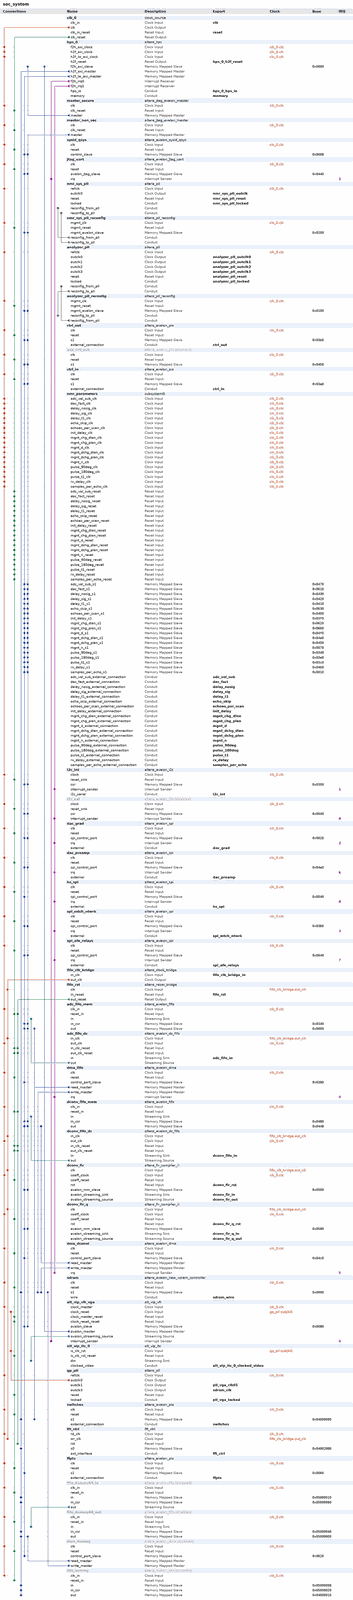
[diagram p0: system contents, whole]
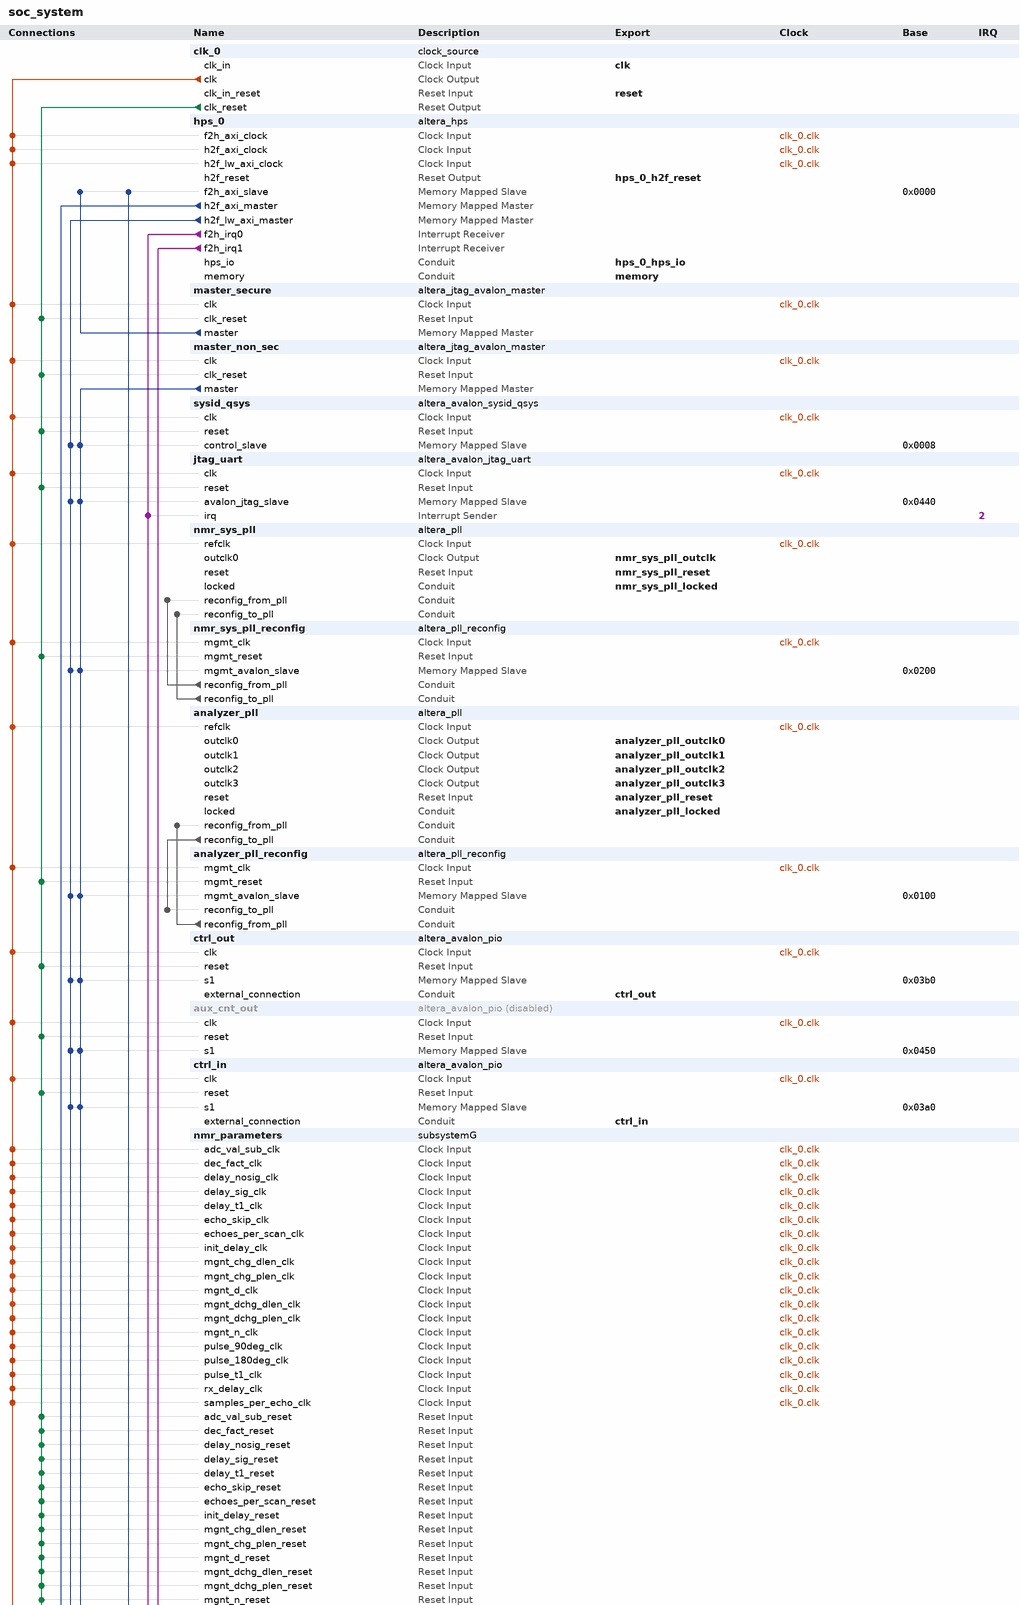
[diagram p1: system contents, upper part]
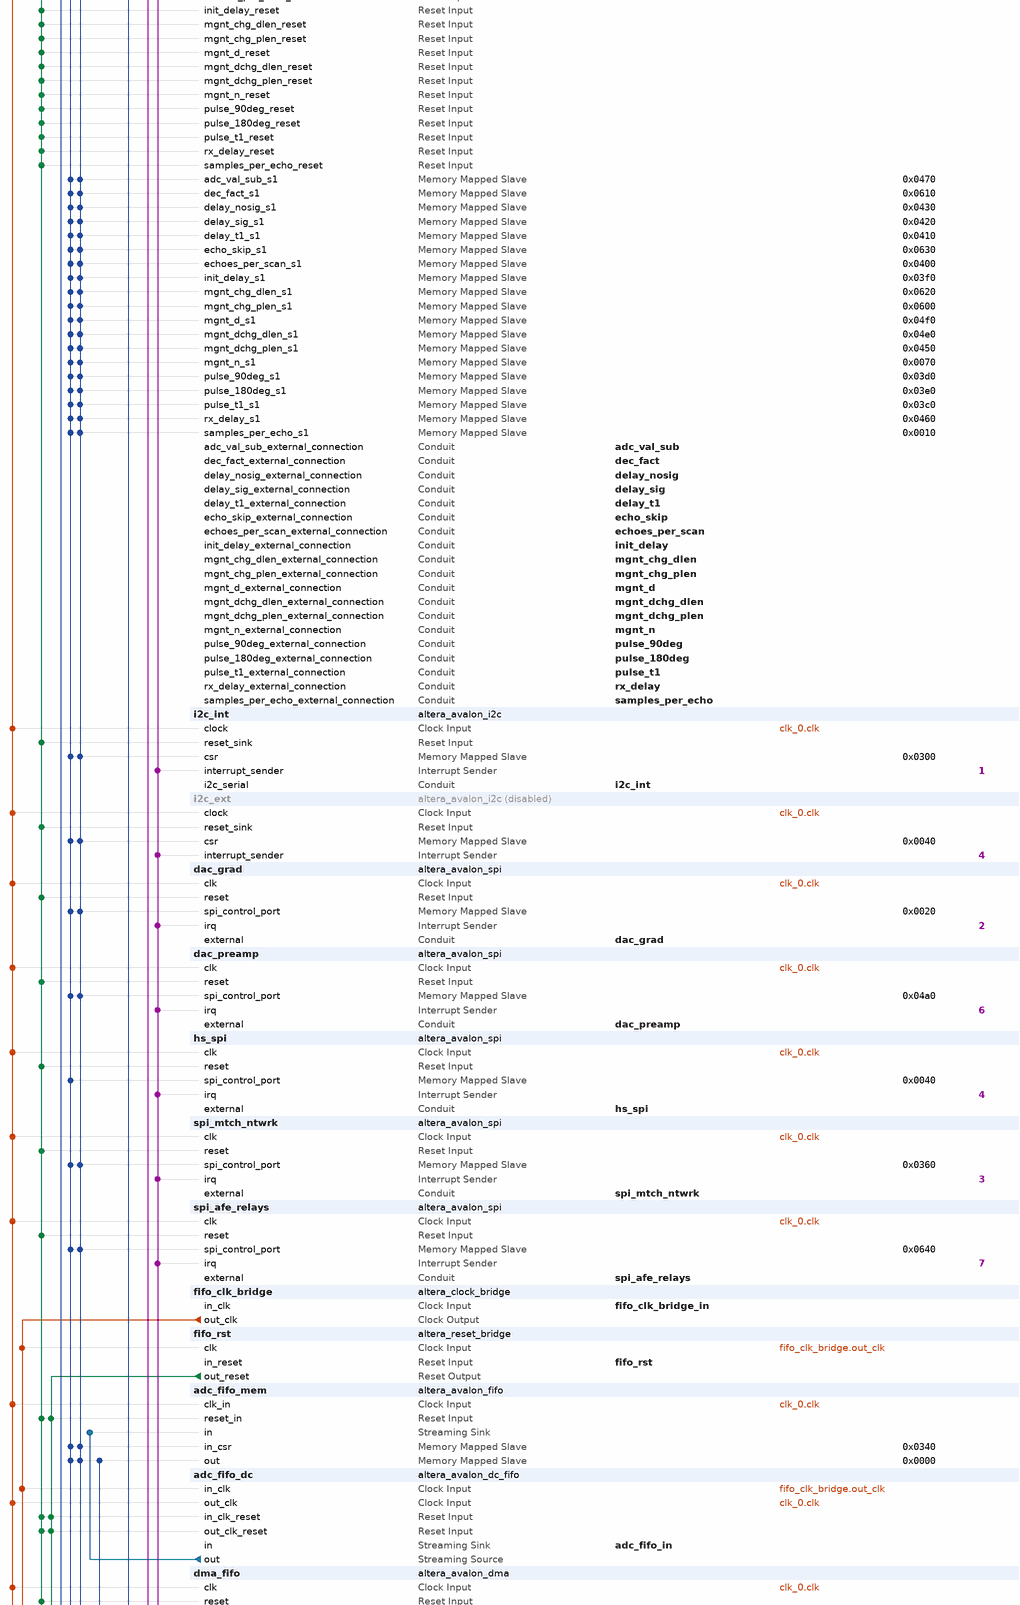
[diagram p2: system contents, middle part]
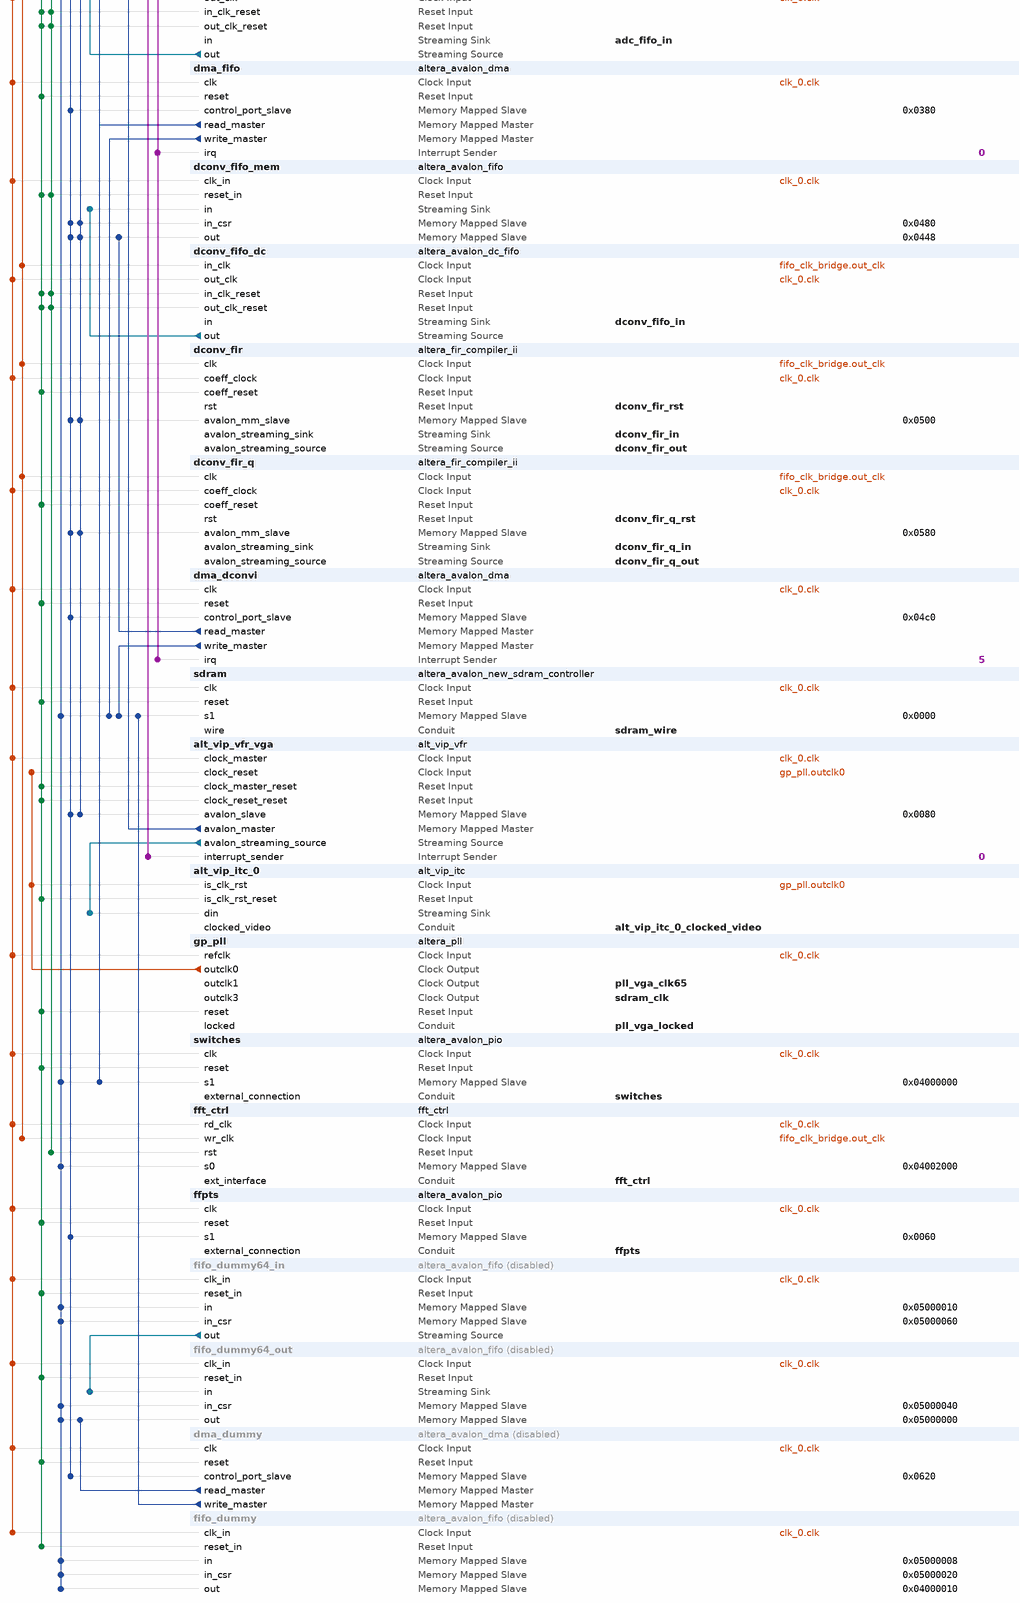
[diagram p3: system contents, lower part]
# Platform Designer (Qsys) system soc_system, Cyclone V 5CSEMA5F31C6
# Parameters at their usual value, and those the tool derives, are not listed.
package require -exact qsys 17.1
create_system soc_system
set_project_property DEVICE_FAMILY {Cyclone V}
set_project_property DEVICE 5CSEMA5F31C6

add_instance clk_0 clock_source 17.1
set_instance_parameter_value clk_0 clockFrequency 50000000

add_instance hps_0 altera_hps 17.1
set_instance_parameter_value hps_0 EMAC1_Mode RGMII
set_instance_parameter_value hps_0 EMAC1_PinMuxing {HPS I/O Set 0}
set_instance_parameter_value hps_0 F2SCLK_COLDRST_Enable false
set_instance_parameter_value hps_0 F2SCLK_DBGRST_Enable false
set_instance_parameter_value hps_0 F2SCLK_WARMRST_Enable false
set_instance_parameter_value hps_0 F2SINTERRUPT_Enable true
set_instance_parameter_value hps_0 F2S_Width 3
set_instance_parameter_value hps_0 FPGA_PERIPHERAL_OUTPUT_CLOCK_FREQ_EMAC0_GTX_CLK 100
set_instance_parameter_value hps_0 FPGA_PERIPHERAL_OUTPUT_CLOCK_FREQ_EMAC0_MD_CLK 100.0
set_instance_parameter_value hps_0 FPGA_PERIPHERAL_OUTPUT_CLOCK_FREQ_EMAC1_GTX_CLK 100
set_instance_parameter_value hps_0 FPGA_PERIPHERAL_OUTPUT_CLOCK_FREQ_EMAC1_MD_CLK 100.0
set_instance_parameter_value hps_0 HPS_PROTOCOL DDR3
set_instance_parameter_value hps_0 I2C0_Mode I2C
set_instance_parameter_value hps_0 I2C0_PinMuxing {HPS I/O Set 0}
set_instance_parameter_value hps_0 I2C1_Mode I2C
set_instance_parameter_value hps_0 I2C1_PinMuxing {HPS I/O Set 0}
set_instance_parameter_value hps_0 LWH2F_Enable true
set_instance_parameter_value hps_0 MEM_BANKADDR_WIDTH 3
set_instance_parameter_value hps_0 MEM_CLK_FREQ 400.0
set_instance_parameter_value hps_0 MEM_COL_ADDR_WIDTH 10
set_instance_parameter_value hps_0 MEM_DQ_WIDTH 32
set_instance_parameter_value hps_0 MEM_DRV_STR RZQ/7
set_instance_parameter_value hps_0 MEM_ROW_ADDR_WIDTH 15
set_instance_parameter_value hps_0 MEM_RTT_NOM RZQ/4
set_instance_parameter_value hps_0 MEM_RTT_WR RZQ/4
set_instance_parameter_value hps_0 MEM_TCL 11
set_instance_parameter_value hps_0 MEM_TFAW_NS 30.0
set_instance_parameter_value hps_0 MEM_TRAS_NS 35.0
set_instance_parameter_value hps_0 MEM_TRCD_NS 13.75
set_instance_parameter_value hps_0 MEM_TRFC_NS 260.0
set_instance_parameter_value hps_0 MEM_TRP_NS 13.75
set_instance_parameter_value hps_0 MEM_VENDOR JEDEC
set_instance_parameter_value hps_0 MEM_WTCL 8
set_instance_parameter_value hps_0 QSPI_Mode {1 SS}
set_instance_parameter_value hps_0 QSPI_PinMuxing {HPS I/O Set 0}
set_instance_parameter_value hps_0 REF_CLK_FREQ 25.0
set_instance_parameter_value hps_0 S2FCLK_USER2CLK 5
set_instance_parameter_value hps_0 S2F_Width 3
set_instance_parameter_value hps_0 SDIO_Mode {4-bit Data}
set_instance_parameter_value hps_0 SDIO_PinMuxing {HPS I/O Set 0}
set_instance_parameter_value hps_0 SPIM1_Mode {Single Slave Select}
set_instance_parameter_value hps_0 SPIM1_PinMuxing {HPS I/O Set 0}
set_instance_parameter_value hps_0 STM_Enable false
set_instance_parameter_value hps_0 TIMING_BOARD_AC_SKEW 0.03
set_instance_parameter_value hps_0 TIMING_BOARD_AC_TO_CK_SKEW 0.0
set_instance_parameter_value hps_0 TIMING_BOARD_DQ_TO_DQS_SKEW 0.0
set_instance_parameter_value hps_0 TIMING_BOARD_MAX_CK_DELAY 0.03
set_instance_parameter_value hps_0 TIMING_BOARD_MAX_DQS_DELAY 0.02
set_instance_parameter_value hps_0 TIMING_BOARD_SKEW_BETWEEN_DQS 0.08
set_instance_parameter_value hps_0 TIMING_BOARD_SKEW_CKDQS_DIMM_MAX 0.16
set_instance_parameter_value hps_0 TIMING_BOARD_SKEW_CKDQS_DIMM_MIN 0.09
set_instance_parameter_value hps_0 TIMING_BOARD_SKEW_WITHIN_DQS 0.01
set_instance_parameter_value hps_0 TIMING_TDH 65
set_instance_parameter_value hps_0 TIMING_TDQSCK 255
set_instance_parameter_value hps_0 TIMING_TDQSQ 125
set_instance_parameter_value hps_0 TIMING_TDS 30
set_instance_parameter_value hps_0 TIMING_TIH 140
set_instance_parameter_value hps_0 TIMING_TIS 180
set_instance_parameter_value hps_0 TIMING_TQSH 0.4
set_instance_parameter_value hps_0 UART0_Mode {No Flow Control}
set_instance_parameter_value hps_0 UART0_PinMuxing {HPS I/O Set 0}
set_instance_parameter_value hps_0 USB1_Mode SDR
set_instance_parameter_value hps_0 USB1_PinMuxing {HPS I/O Set 0}
set_instance_parameter_value hps_0 desired_cfg_clk_mhz 97.368421
set_instance_parameter_value hps_0 desired_qspi_clk_mhz 370.0

add_instance master_secure altera_jtag_avalon_master 17.1

add_instance master_non_sec altera_jtag_avalon_master 17.1

add_instance sysid_qsys altera_avalon_sysid_qsys 17.1
set_instance_parameter_value sysid_qsys id -1395322110

add_instance jtag_uart altera_avalon_jtag_uart 17.1
set_instance_parameter_value jtag_uart allowMultipleConnections true
set_instance_parameter_value jtag_uart simInteractiveOptions INTERACTIVE_ASCII_OUTPUT

add_instance nmr_sys_pll altera_pll 17.1
set_instance_parameter_value nmr_sys_pll gui_device_speed_grade 2
set_instance_parameter_value nmr_sys_pll gui_en_reconf true
set_instance_parameter_value nmr_sys_pll gui_number_of_clocks 1
set_instance_parameter_value nmr_sys_pll gui_operation_mode direct
set_instance_parameter_value nmr_sys_pll gui_output_clock_frequency0 120.0
set_instance_parameter_value nmr_sys_pll gui_pll_mode {Fractional-N PLL}
set_instance_parameter_value nmr_sys_pll gui_reference_clock_frequency 50.0
set_instance_parameter_value nmr_sys_pll gui_use_locked true

add_instance nmr_sys_pll_reconfig altera_pll_reconfig 17.1

add_instance analyzer_pll altera_pll 17.1
set_instance_parameter_value analyzer_pll gui_device_speed_grade 2
set_instance_parameter_value analyzer_pll gui_en_reconf true
set_instance_parameter_value analyzer_pll gui_number_of_clocks 4
set_instance_parameter_value analyzer_pll gui_operation_mode direct
set_instance_parameter_value analyzer_pll gui_output_clock_frequency0 4.3
set_instance_parameter_value analyzer_pll gui_output_clock_frequency1 4.3
set_instance_parameter_value analyzer_pll gui_output_clock_frequency2 4.3
set_instance_parameter_value analyzer_pll gui_output_clock_frequency3 4.3
set_instance_parameter_value analyzer_pll gui_pll_mode {Fractional-N PLL}
set_instance_parameter_value analyzer_pll gui_reference_clock_frequency 50.0
set_instance_parameter_value analyzer_pll gui_use_locked true

add_instance analyzer_pll_reconfig altera_pll_reconfig 17.1

add_instance ctrl_out altera_avalon_pio 17.1
set_instance_parameter_value ctrl_out direction Output
set_instance_parameter_value ctrl_out resetValue 119
set_instance_parameter_value ctrl_out width 32

add_instance aux_cnt_out altera_avalon_pio 17.1
set_instance_property aux_cnt_out ENABLED false
set_instance_parameter_value aux_cnt_out direction Output
set_instance_parameter_value aux_cnt_out resetValue 119
set_instance_parameter_value aux_cnt_out width 32

add_instance ctrl_in altera_avalon_pio 17.1
set_instance_parameter_value ctrl_in direction Input
set_instance_parameter_value ctrl_in width 8

add_instance nmr_parameters subsystemG 1.0

add_instance i2c_int altera_avalon_i2c 17.1
set_instance_parameter_value i2c_int FIFO_DEPTH 32

add_instance i2c_ext altera_avalon_i2c 17.1
set_instance_property i2c_ext ENABLED false
set_instance_parameter_value i2c_ext FIFO_DEPTH 32

add_instance dac_grad altera_avalon_spi 17.1
set_instance_parameter_value dac_grad clockPolarity 1
set_instance_parameter_value dac_grad dataWidth 24
set_instance_parameter_value dac_grad masterSPI true
set_instance_parameter_value dac_grad numberOfSlaves 1
set_instance_parameter_value dac_grad targetClockRate 128000

add_instance dac_preamp altera_avalon_spi 17.1
set_instance_parameter_value dac_preamp clockPolarity 1
set_instance_parameter_value dac_preamp dataWidth 24
set_instance_parameter_value dac_preamp masterSPI true
set_instance_parameter_value dac_preamp numberOfSlaves 1
set_instance_parameter_value dac_preamp targetClockRate 128000

add_instance hs_spi altera_avalon_spi 17.1
set_instance_parameter_value hs_spi clockPolarity 0
set_instance_parameter_value hs_spi dataWidth 16
set_instance_parameter_value hs_spi masterSPI true
set_instance_parameter_value hs_spi numberOfSlaves 1
set_instance_parameter_value hs_spi targetClockRate 128000

add_instance spi_mtch_ntwrk altera_avalon_spi 17.1
set_instance_parameter_value spi_mtch_ntwrk clockPolarity 0
set_instance_parameter_value spi_mtch_ntwrk dataWidth 24
set_instance_parameter_value spi_mtch_ntwrk lsbOrderedFirst true
set_instance_parameter_value spi_mtch_ntwrk masterSPI true
set_instance_parameter_value spi_mtch_ntwrk numberOfSlaves 1
set_instance_parameter_value spi_mtch_ntwrk targetClockRate 128000

add_instance spi_afe_relays altera_avalon_spi 17.1
set_instance_parameter_value spi_afe_relays clockPolarity 0
set_instance_parameter_value spi_afe_relays dataWidth 8
set_instance_parameter_value spi_afe_relays masterSPI true
set_instance_parameter_value spi_afe_relays numberOfSlaves 1
set_instance_parameter_value spi_afe_relays targetClockRate 128000

add_instance fifo_clk_bridge altera_clock_bridge 17.1
set_instance_parameter_value fifo_clk_bridge DERIVED_CLOCK_RATE 0
set_instance_parameter_value fifo_clk_bridge EXPLICIT_CLOCK_RATE 0

add_instance fifo_rst altera_reset_bridge 17.1
set_instance_parameter_value fifo_rst ACTIVE_LOW_RESET 0
set_instance_parameter_value fifo_rst SYNCHRONOUS_EDGES deassert

add_instance adc_fifo_mem altera_avalon_fifo 17.1
set_instance_parameter_value adc_fifo_mem bitsPerSymbol 32
set_instance_parameter_value adc_fifo_mem channelWidth 0
set_instance_parameter_value adc_fifo_mem errorWidth 0
set_instance_parameter_value adc_fifo_mem fifoDepth 1024
set_instance_parameter_value adc_fifo_mem fifoInputInterfaceOptions AVALONST_SINK
set_instance_parameter_value adc_fifo_mem fifoOutputInterfaceOptions AVALONMM_READ
set_instance_parameter_value adc_fifo_mem singleClockMode true
set_instance_parameter_value adc_fifo_mem symbolsPerBeat 1
set_instance_parameter_value adc_fifo_mem useIRQ false
set_instance_parameter_value adc_fifo_mem usePacket false
set_instance_parameter_value adc_fifo_mem useReadControl false

add_instance adc_fifo_dc altera_avalon_dc_fifo 17.1
set_instance_parameter_value adc_fifo_dc BITS_PER_SYMBOL 32
set_instance_parameter_value adc_fifo_dc FIFO_DEPTH 16384
set_instance_parameter_value adc_fifo_dc USE_PACKETS 0

add_instance dma_fifo altera_avalon_dma 17.1
set_instance_parameter_value dma_fifo allowByteTransactions false
set_instance_parameter_value dma_fifo allowDoubleWordTransactions false
set_instance_parameter_value dma_fifo allowHalfWordTransactions false
set_instance_parameter_value dma_fifo allowQuadWordTransactions false
set_instance_parameter_value dma_fifo burstEnable false
set_instance_parameter_value dma_fifo fifoDepth 1024
set_instance_parameter_value dma_fifo maxBurstSize 1024
set_instance_parameter_value dma_fifo minimumDmaTransactionRegisterWidth 32

add_instance dconv_fifo_mem altera_avalon_fifo 17.1
set_instance_parameter_value dconv_fifo_mem bitsPerSymbol 32
set_instance_parameter_value dconv_fifo_mem channelWidth 0
set_instance_parameter_value dconv_fifo_mem errorWidth 0
set_instance_parameter_value dconv_fifo_mem fifoDepth 1024
set_instance_parameter_value dconv_fifo_mem fifoInputInterfaceOptions AVALONST_SINK
set_instance_parameter_value dconv_fifo_mem fifoOutputInterfaceOptions AVALONMM_READ
set_instance_parameter_value dconv_fifo_mem singleClockMode true
set_instance_parameter_value dconv_fifo_mem symbolsPerBeat 1
set_instance_parameter_value dconv_fifo_mem useIRQ false
set_instance_parameter_value dconv_fifo_mem usePacket false
set_instance_parameter_value dconv_fifo_mem useReadControl false

add_instance dconv_fifo_dc altera_avalon_dc_fifo 17.1
set_instance_parameter_value dconv_fifo_dc BITS_PER_SYMBOL 32
set_instance_parameter_value dconv_fifo_dc FIFO_DEPTH 65536
set_instance_parameter_value dconv_fifo_dc USE_PACKETS 0

add_instance dconv_fir altera_fir_compiler_ii 17.1
set_instance_parameter_value dconv_fir coeffBitWidth 11
set_instance_parameter_value dconv_fir coeffFracBitWidth 0
set_instance_parameter_value dconv_fir coeffReload true
set_instance_parameter_value dconv_fir coeffType int
set_instance_parameter_value dconv_fir inputBitWidth 15
set_instance_parameter_value dconv_fir inputChannelNum 1
set_instance_parameter_value dconv_fir inputFracBitWidth 0
set_instance_parameter_value dconv_fir inputRate 25
set_instance_parameter_value dconv_fir inputType int
set_instance_parameter_value dconv_fir outLsbBitRem 0
set_instance_parameter_value dconv_fir outMsbBitRem 0
set_instance_parameter_value dconv_fir outType int
set_instance_parameter_value dconv_fir readWriteMode write
set_instance_parameter_value dconv_fir speedGrade medium

add_instance dconv_fir_q altera_fir_compiler_ii 17.1
set_instance_parameter_value dconv_fir_q coeffBitWidth 11
set_instance_parameter_value dconv_fir_q coeffFracBitWidth 0
set_instance_parameter_value dconv_fir_q coeffReload true
set_instance_parameter_value dconv_fir_q coeffType int
set_instance_parameter_value dconv_fir_q inputBitWidth 15
set_instance_parameter_value dconv_fir_q inputChannelNum 1
set_instance_parameter_value dconv_fir_q inputFracBitWidth 0
set_instance_parameter_value dconv_fir_q inputRate 25
set_instance_parameter_value dconv_fir_q inputType int
set_instance_parameter_value dconv_fir_q outLsbBitRem 0
set_instance_parameter_value dconv_fir_q outMsbBitRem 0
set_instance_parameter_value dconv_fir_q outType int
set_instance_parameter_value dconv_fir_q readWriteMode write
set_instance_parameter_value dconv_fir_q speedGrade medium

add_instance dma_dconvi altera_avalon_dma 17.1
set_instance_parameter_value dma_dconvi allowByteTransactions false
set_instance_parameter_value dma_dconvi allowDoubleWordTransactions false
set_instance_parameter_value dma_dconvi allowHalfWordTransactions false
set_instance_parameter_value dma_dconvi allowQuadWordTransactions false
set_instance_parameter_value dma_dconvi burstEnable false
set_instance_parameter_value dma_dconvi fifoDepth 1024
set_instance_parameter_value dma_dconvi maxBurstSize 4
set_instance_parameter_value dma_dconvi minimumDmaTransactionRegisterWidth 32

add_instance sdram altera_avalon_new_sdram_controller 17.1
set_instance_parameter_value sdram TAC 5.4
set_instance_parameter_value sdram TRCD 15.0
set_instance_parameter_value sdram TRP 15.0
set_instance_parameter_value sdram casLatency 3
set_instance_parameter_value sdram columnWidth 10
set_instance_parameter_value sdram dataWidth 16
set_instance_parameter_value sdram generateSimulationModel true
set_instance_parameter_value sdram model single_Micron_MT48LC4M32B2_7_chip
set_instance_parameter_value sdram numberOfBanks 4
set_instance_parameter_value sdram numberOfChipSelects 1
set_instance_parameter_value sdram powerUpDelay 100.0
set_instance_parameter_value sdram refreshPeriod 7.8125
set_instance_parameter_value sdram rowWidth 13

add_instance alt_vip_vfr_vga alt_vip_vfr 14.0
set_instance_parameter_value alt_vip_vfr_vga MAX_IMAGE_WIDTH 1024

add_instance alt_vip_itc_0 alt_vip_itc 14.0
set_instance_parameter_value alt_vip_itc_0 FIFO_DEPTH 1920
set_instance_parameter_value alt_vip_itc_0 H_ACTIVE_PIXELS 1024
set_instance_parameter_value alt_vip_itc_0 H_BACK_PORCH 160
set_instance_parameter_value alt_vip_itc_0 H_FRONT_PORCH 24
set_instance_parameter_value alt_vip_itc_0 H_SYNC_LENGTH 136
set_instance_parameter_value alt_vip_itc_0 NUMBER_OF_COLOUR_PLANES 4
set_instance_parameter_value alt_vip_itc_0 THRESHOLD 1919
set_instance_parameter_value alt_vip_itc_0 V_ACTIVE_LINES 768
set_instance_parameter_value alt_vip_itc_0 V_BACK_PORCH 29
set_instance_parameter_value alt_vip_itc_0 V_FRONT_PORCH 3
set_instance_parameter_value alt_vip_itc_0 V_SYNC_LENGTH 6

add_instance gp_pll altera_pll 17.1
set_instance_parameter_value gp_pll gui_device_speed_grade 2
set_instance_parameter_value gp_pll gui_number_of_clocks 4
set_instance_parameter_value gp_pll gui_operation_mode normal
set_instance_parameter_value gp_pll gui_output_clock_frequency0 130.0
set_instance_parameter_value gp_pll gui_output_clock_frequency1 65.0
set_instance_parameter_value gp_pll gui_output_clock_frequency2 50.0
set_instance_parameter_value gp_pll gui_output_clock_frequency3 50.0
set_instance_parameter_value gp_pll gui_phase_shift3 -3800
set_instance_parameter_value gp_pll gui_pll_mode {Integer-N PLL}
set_instance_parameter_value gp_pll gui_reference_clock_frequency 50.0
set_instance_parameter_value gp_pll gui_use_locked true

add_instance switches altera_avalon_pio 17.1
set_instance_parameter_value switches direction Input
set_instance_parameter_value switches simDoTestBenchWiring true
set_instance_parameter_value switches width 10

add_instance fft_ctrl fft_ctrl 1.0
set_instance_parameter_value fft_ctrl BUSWIDTH 32
set_instance_parameter_value fft_ctrl DWIDTH 15
set_instance_parameter_value fft_ctrl FFTPTS_WIDTH 11
set_instance_parameter_value fft_ctrl FFT_INWIDTH 18
set_instance_parameter_value fft_ctrl FFT_OUTWIDTH 29
set_instance_parameter_value fft_ctrl RAM_ADDR_WIDTH 10
set_instance_parameter_value fft_ctrl RAM_DATA_WIDTH 64

add_instance ffpts altera_avalon_pio 17.1
set_instance_parameter_value ffpts direction Output
set_instance_parameter_value ffpts width 32

add_instance fifo_dummy64_in altera_avalon_fifo 17.1
set_instance_property fifo_dummy64_in ENABLED false
set_instance_parameter_value fifo_dummy64_in avalonMMAvalonMMDataWidth 64
set_instance_parameter_value fifo_dummy64_in bitsPerSymbol 32
set_instance_parameter_value fifo_dummy64_in channelWidth 0
set_instance_parameter_value fifo_dummy64_in errorWidth 0
set_instance_parameter_value fifo_dummy64_in fifoDepth 128
set_instance_parameter_value fifo_dummy64_in fifoInputInterfaceOptions AVALONMM_WRITE
set_instance_parameter_value fifo_dummy64_in fifoOutputInterfaceOptions AVALONST_SOURCE
set_instance_parameter_value fifo_dummy64_in singleClockMode true
set_instance_parameter_value fifo_dummy64_in symbolsPerBeat 1
set_instance_parameter_value fifo_dummy64_in useIRQ false
set_instance_parameter_value fifo_dummy64_in usePacket false
set_instance_parameter_value fifo_dummy64_in useReadControl false

add_instance fifo_dummy64_out altera_avalon_fifo 17.1
set_instance_property fifo_dummy64_out ENABLED false
set_instance_parameter_value fifo_dummy64_out avalonMMAvalonMMDataWidth 64
set_instance_parameter_value fifo_dummy64_out bitsPerSymbol 32
set_instance_parameter_value fifo_dummy64_out channelWidth 0
set_instance_parameter_value fifo_dummy64_out errorWidth 0
set_instance_parameter_value fifo_dummy64_out fifoDepth 128
set_instance_parameter_value fifo_dummy64_out fifoInputInterfaceOptions AVALONST_SINK
set_instance_parameter_value fifo_dummy64_out fifoOutputInterfaceOptions AVALONMM_READ
set_instance_parameter_value fifo_dummy64_out singleClockMode true
set_instance_parameter_value fifo_dummy64_out symbolsPerBeat 1
set_instance_parameter_value fifo_dummy64_out useIRQ false
set_instance_parameter_value fifo_dummy64_out usePacket false
set_instance_parameter_value fifo_dummy64_out useReadControl false

add_instance dma_dummy altera_avalon_dma 17.1
set_instance_property dma_dummy ENABLED false
set_instance_parameter_value dma_dummy allowByteTransactions false
set_instance_parameter_value dma_dummy allowDoubleWordTransactions false
set_instance_parameter_value dma_dummy allowHalfWordTransactions false
set_instance_parameter_value dma_dummy allowQuadWordTransactions false
set_instance_parameter_value dma_dummy burstEnable false
set_instance_parameter_value dma_dummy fifoDepth 1024
set_instance_parameter_value dma_dummy maxBurstSize 128
set_instance_parameter_value dma_dummy minimumDmaTransactionRegisterWidth 32

add_instance fifo_dummy altera_avalon_fifo 17.1
set_instance_property fifo_dummy ENABLED false
set_instance_parameter_value fifo_dummy bitsPerSymbol 32
set_instance_parameter_value fifo_dummy channelWidth 0
set_instance_parameter_value fifo_dummy errorWidth 0
set_instance_parameter_value fifo_dummy fifoDepth 128
set_instance_parameter_value fifo_dummy fifoInputInterfaceOptions AVALONMM_WRITE
set_instance_parameter_value fifo_dummy fifoOutputInterfaceOptions AVALONMM_READ
set_instance_parameter_value fifo_dummy singleClockMode true
set_instance_parameter_value fifo_dummy symbolsPerBeat 1
set_instance_parameter_value fifo_dummy useIRQ false
set_instance_parameter_value fifo_dummy usePacket false
set_instance_parameter_value fifo_dummy useReadControl false

# connections
add_connection clk_0.clk adc_fifo_dc.out_clk clock
add_connection clk_0.clk adc_fifo_mem.clk_in clock
add_connection clk_0.clk alt_vip_vfr_vga.clock_master clock
add_connection clk_0.clk analyzer_pll.refclk clock
add_connection clk_0.clk analyzer_pll_reconfig.mgmt_clk clock
add_connection clk_0.clk aux_cnt_out.clk clock
add_connection clk_0.clk ctrl_in.clk clock
add_connection clk_0.clk ctrl_out.clk clock
add_connection clk_0.clk dac_grad.clk clock
add_connection clk_0.clk dac_preamp.clk clock
add_connection clk_0.clk dconv_fifo_dc.out_clk clock
add_connection clk_0.clk dconv_fifo_mem.clk_in clock
add_connection clk_0.clk dconv_fir.coeff_clock clock
add_connection clk_0.clk dconv_fir_q.coeff_clock clock
add_connection clk_0.clk dma_dconvi.clk clock
add_connection clk_0.clk dma_dummy.clk clock
add_connection clk_0.clk dma_fifo.clk clock
add_connection clk_0.clk ffpts.clk clock
add_connection clk_0.clk fft_ctrl.rd_clk clock
add_connection clk_0.clk fifo_dummy64_in.clk_in clock
add_connection clk_0.clk fifo_dummy64_out.clk_in clock
add_connection clk_0.clk fifo_dummy.clk_in clock
add_connection clk_0.clk gp_pll.refclk clock
add_connection clk_0.clk hps_0.f2h_axi_clock clock
add_connection clk_0.clk hps_0.h2f_axi_clock clock
add_connection clk_0.clk hps_0.h2f_lw_axi_clock clock
add_connection clk_0.clk hs_spi.clk clock
add_connection clk_0.clk i2c_ext.clock clock
add_connection clk_0.clk i2c_int.clock clock
add_connection clk_0.clk jtag_uart.clk clock
add_connection clk_0.clk master_non_sec.clk clock
add_connection clk_0.clk master_secure.clk clock
add_connection clk_0.clk nmr_parameters.adc_val_sub_clk clock
add_connection clk_0.clk nmr_parameters.dec_fact_clk clock
add_connection clk_0.clk nmr_parameters.delay_nosig_clk clock
add_connection clk_0.clk nmr_parameters.delay_sig_clk clock
add_connection clk_0.clk nmr_parameters.delay_t1_clk clock
add_connection clk_0.clk nmr_parameters.echo_skip_clk clock
add_connection clk_0.clk nmr_parameters.echoes_per_scan_clk clock
add_connection clk_0.clk nmr_parameters.init_delay_clk clock
add_connection clk_0.clk nmr_parameters.mgnt_chg_dlen_clk clock
add_connection clk_0.clk nmr_parameters.mgnt_chg_plen_clk clock
add_connection clk_0.clk nmr_parameters.mgnt_d_clk clock
add_connection clk_0.clk nmr_parameters.mgnt_dchg_dlen_clk clock
add_connection clk_0.clk nmr_parameters.mgnt_dchg_plen_clk clock
add_connection clk_0.clk nmr_parameters.mgnt_n_clk clock
add_connection clk_0.clk nmr_parameters.pulse_90deg_clk clock
add_connection clk_0.clk nmr_parameters.pulse_180deg_clk clock
add_connection clk_0.clk nmr_parameters.pulse_t1_clk clock
add_connection clk_0.clk nmr_parameters.rx_delay_clk clock
add_connection clk_0.clk nmr_parameters.samples_per_echo_clk clock
add_connection clk_0.clk nmr_sys_pll.refclk clock
add_connection clk_0.clk nmr_sys_pll_reconfig.mgmt_clk clock
add_connection clk_0.clk sdram.clk clock
add_connection clk_0.clk spi_afe_relays.clk clock
add_connection clk_0.clk spi_mtch_ntwrk.clk clock
add_connection clk_0.clk switches.clk clock
add_connection clk_0.clk sysid_qsys.clk clock
add_connection fifo_clk_bridge.out_clk adc_fifo_dc.in_clk clock
add_connection fifo_clk_bridge.out_clk dconv_fifo_dc.in_clk clock
add_connection fifo_clk_bridge.out_clk dconv_fir.clk clock
add_connection fifo_clk_bridge.out_clk dconv_fir_q.clk clock
add_connection fifo_clk_bridge.out_clk fft_ctrl.wr_clk clock
add_connection fifo_clk_bridge.out_clk fifo_rst.clk clock
add_connection gp_pll.outclk0 alt_vip_itc_0.is_clk_rst clock
add_connection gp_pll.outclk0 alt_vip_vfr_vga.clock_reset clock
add_connection clk_0.clk_reset adc_fifo_dc.in_clk_reset reset
add_connection clk_0.clk_reset adc_fifo_dc.out_clk_reset reset
add_connection clk_0.clk_reset adc_fifo_mem.reset_in reset
add_connection clk_0.clk_reset alt_vip_itc_0.is_clk_rst_reset reset
add_connection clk_0.clk_reset alt_vip_vfr_vga.clock_master_reset reset
add_connection clk_0.clk_reset alt_vip_vfr_vga.clock_reset_reset reset
add_connection clk_0.clk_reset analyzer_pll_reconfig.mgmt_reset reset
add_connection clk_0.clk_reset aux_cnt_out.reset reset
add_connection clk_0.clk_reset ctrl_in.reset reset
add_connection clk_0.clk_reset ctrl_out.reset reset
add_connection clk_0.clk_reset dac_grad.reset reset
add_connection clk_0.clk_reset dac_preamp.reset reset
add_connection clk_0.clk_reset dconv_fifo_dc.in_clk_reset reset
add_connection clk_0.clk_reset dconv_fifo_dc.out_clk_reset reset
add_connection clk_0.clk_reset dconv_fifo_mem.reset_in reset
add_connection clk_0.clk_reset dconv_fir.coeff_reset reset
add_connection clk_0.clk_reset dconv_fir_q.coeff_reset reset
add_connection clk_0.clk_reset dma_dconvi.reset reset
add_connection clk_0.clk_reset dma_dummy.reset reset
add_connection clk_0.clk_reset dma_fifo.reset reset
add_connection clk_0.clk_reset ffpts.reset reset
add_connection clk_0.clk_reset fifo_dummy64_in.reset_in reset
add_connection clk_0.clk_reset fifo_dummy64_out.reset_in reset
add_connection clk_0.clk_reset fifo_dummy.reset_in reset
add_connection clk_0.clk_reset gp_pll.reset reset
add_connection clk_0.clk_reset hs_spi.reset reset
add_connection clk_0.clk_reset i2c_ext.reset_sink reset
add_connection clk_0.clk_reset i2c_int.reset_sink reset
add_connection clk_0.clk_reset jtag_uart.reset reset
add_connection clk_0.clk_reset master_non_sec.clk_reset reset
add_connection clk_0.clk_reset master_secure.clk_reset reset
add_connection clk_0.clk_reset nmr_parameters.adc_val_sub_reset reset
add_connection clk_0.clk_reset nmr_parameters.dec_fact_reset reset
add_connection clk_0.clk_reset nmr_parameters.delay_nosig_reset reset
add_connection clk_0.clk_reset nmr_parameters.delay_sig_reset reset
add_connection clk_0.clk_reset nmr_parameters.delay_t1_reset reset
add_connection clk_0.clk_reset nmr_parameters.echo_skip_reset reset
add_connection clk_0.clk_reset nmr_parameters.echoes_per_scan_reset reset
add_connection clk_0.clk_reset nmr_parameters.init_delay_reset reset
add_connection clk_0.clk_reset nmr_parameters.mgnt_chg_dlen_reset reset
add_connection clk_0.clk_reset nmr_parameters.mgnt_chg_plen_reset reset
add_connection clk_0.clk_reset nmr_parameters.mgnt_d_reset reset
add_connection clk_0.clk_reset nmr_parameters.mgnt_dchg_dlen_reset reset
add_connection clk_0.clk_reset nmr_parameters.mgnt_dchg_plen_reset reset
add_connection clk_0.clk_reset nmr_parameters.mgnt_n_reset reset
add_connection clk_0.clk_reset nmr_parameters.pulse_90deg_reset reset
add_connection clk_0.clk_reset nmr_parameters.pulse_180deg_reset reset
add_connection clk_0.clk_reset nmr_parameters.pulse_t1_reset reset
add_connection clk_0.clk_reset nmr_parameters.rx_delay_reset reset
add_connection clk_0.clk_reset nmr_parameters.samples_per_echo_reset reset
add_connection clk_0.clk_reset nmr_sys_pll_reconfig.mgmt_reset reset
add_connection clk_0.clk_reset sdram.reset reset
add_connection clk_0.clk_reset spi_afe_relays.reset reset
add_connection clk_0.clk_reset spi_mtch_ntwrk.reset reset
add_connection clk_0.clk_reset switches.reset reset
add_connection clk_0.clk_reset sysid_qsys.reset reset
add_connection fifo_rst.out_reset adc_fifo_dc.in_clk_reset reset
add_connection fifo_rst.out_reset adc_fifo_dc.out_clk_reset reset
add_connection fifo_rst.out_reset adc_fifo_mem.reset_in reset
add_connection fifo_rst.out_reset dconv_fifo_dc.in_clk_reset reset
add_connection fifo_rst.out_reset dconv_fifo_dc.out_clk_reset reset
add_connection fifo_rst.out_reset dconv_fifo_mem.reset_in reset
add_connection fifo_rst.out_reset fft_ctrl.rst reset
add_connection alt_vip_vfr_vga.avalon_master hps_0.f2h_axi_slave avalon
set_connection_parameter_value alt_vip_vfr_vga.avalon_master/hps_0.f2h_axi_slave baseAddress 0x0000
add_connection dma_dconvi.read_master dconv_fifo_mem.out avalon
set_connection_parameter_value dma_dconvi.read_master/dconv_fifo_mem.out baseAddress 0x0448
add_connection dma_dconvi.write_master sdram.s1 avalon
set_connection_parameter_value dma_dconvi.write_master/sdram.s1 baseAddress 0x0000
add_connection dma_dummy.read_master fifo_dummy64_out.out avalon
set_connection_parameter_value dma_dummy.read_master/fifo_dummy64_out.out baseAddress 0x05000000
add_connection dma_dummy.write_master sdram.s1 avalon
set_connection_parameter_value dma_dummy.write_master/sdram.s1 baseAddress 0x0000
add_connection dma_fifo.read_master adc_fifo_mem.out avalon
set_connection_parameter_value dma_fifo.read_master/adc_fifo_mem.out baseAddress 0x0000
add_connection dma_fifo.read_master switches.s1 avalon
set_connection_parameter_value dma_fifo.read_master/switches.s1 baseAddress 0x04000000
add_connection dma_fifo.write_master sdram.s1 avalon
set_connection_parameter_value dma_fifo.write_master/sdram.s1 baseAddress 0x0000
add_connection hps_0.h2f_axi_master fft_ctrl.s0 avalon
set_connection_parameter_value hps_0.h2f_axi_master/fft_ctrl.s0 baseAddress 0x04002000
add_connection hps_0.h2f_axi_master fifo_dummy64_in.in avalon
set_connection_parameter_value hps_0.h2f_axi_master/fifo_dummy64_in.in baseAddress 0x05000010
add_connection hps_0.h2f_axi_master fifo_dummy64_in.in_csr avalon
set_connection_parameter_value hps_0.h2f_axi_master/fifo_dummy64_in.in_csr baseAddress 0x05000060
add_connection hps_0.h2f_axi_master fifo_dummy64_out.in_csr avalon
set_connection_parameter_value hps_0.h2f_axi_master/fifo_dummy64_out.in_csr baseAddress 0x05000040
add_connection hps_0.h2f_axi_master fifo_dummy64_out.out avalon
set_connection_parameter_value hps_0.h2f_axi_master/fifo_dummy64_out.out baseAddress 0x05000000
add_connection hps_0.h2f_axi_master fifo_dummy.in avalon
set_connection_parameter_value hps_0.h2f_axi_master/fifo_dummy.in baseAddress 0x05000008
add_connection hps_0.h2f_axi_master fifo_dummy.in_csr avalon
set_connection_parameter_value hps_0.h2f_axi_master/fifo_dummy.in_csr baseAddress 0x05000020
add_connection hps_0.h2f_axi_master fifo_dummy.out avalon
set_connection_parameter_value hps_0.h2f_axi_master/fifo_dummy.out baseAddress 0x04000010
add_connection hps_0.h2f_axi_master sdram.s1 avalon
set_connection_parameter_value hps_0.h2f_axi_master/sdram.s1 baseAddress 0x0000
add_connection hps_0.h2f_axi_master switches.s1 avalon
set_connection_parameter_value hps_0.h2f_axi_master/switches.s1 baseAddress 0x04000000
add_connection hps_0.h2f_lw_axi_master adc_fifo_mem.in_csr avalon
set_connection_parameter_value hps_0.h2f_lw_axi_master/adc_fifo_mem.in_csr baseAddress 0x0340
add_connection hps_0.h2f_lw_axi_master adc_fifo_mem.out avalon
set_connection_parameter_value hps_0.h2f_lw_axi_master/adc_fifo_mem.out baseAddress 0x0000
add_connection hps_0.h2f_lw_axi_master alt_vip_vfr_vga.avalon_slave avalon
set_connection_parameter_value hps_0.h2f_lw_axi_master/alt_vip_vfr_vga.avalon_slave baseAddress 0x0080
add_connection hps_0.h2f_lw_axi_master analyzer_pll_reconfig.mgmt_avalon_slave avalon
set_connection_parameter_value hps_0.h2f_lw_axi_master/analyzer_pll_reconfig.mgmt_avalon_slave baseAddress 0x0100
add_connection hps_0.h2f_lw_axi_master aux_cnt_out.s1 avalon
set_connection_parameter_value hps_0.h2f_lw_axi_master/aux_cnt_out.s1 baseAddress 0x0450
add_connection hps_0.h2f_lw_axi_master ctrl_in.s1 avalon
set_connection_parameter_value hps_0.h2f_lw_axi_master/ctrl_in.s1 baseAddress 0x03a0
add_connection hps_0.h2f_lw_axi_master ctrl_out.s1 avalon
set_connection_parameter_value hps_0.h2f_lw_axi_master/ctrl_out.s1 baseAddress 0x03b0
add_connection hps_0.h2f_lw_axi_master dac_grad.spi_control_port avalon
set_connection_parameter_value hps_0.h2f_lw_axi_master/dac_grad.spi_control_port baseAddress 0x0020
add_connection hps_0.h2f_lw_axi_master dac_preamp.spi_control_port avalon
set_connection_parameter_value hps_0.h2f_lw_axi_master/dac_preamp.spi_control_port baseAddress 0x04a0
add_connection hps_0.h2f_lw_axi_master dconv_fifo_mem.in_csr avalon
set_connection_parameter_value hps_0.h2f_lw_axi_master/dconv_fifo_mem.in_csr baseAddress 0x0480
add_connection hps_0.h2f_lw_axi_master dconv_fifo_mem.out avalon
set_connection_parameter_value hps_0.h2f_lw_axi_master/dconv_fifo_mem.out baseAddress 0x0448
add_connection hps_0.h2f_lw_axi_master dconv_fir.avalon_mm_slave avalon
set_connection_parameter_value hps_0.h2f_lw_axi_master/dconv_fir.avalon_mm_slave baseAddress 0x0500
add_connection hps_0.h2f_lw_axi_master dconv_fir_q.avalon_mm_slave avalon
set_connection_parameter_value hps_0.h2f_lw_axi_master/dconv_fir_q.avalon_mm_slave baseAddress 0x0580
add_connection hps_0.h2f_lw_axi_master dma_dconvi.control_port_slave avalon
set_connection_parameter_value hps_0.h2f_lw_axi_master/dma_dconvi.control_port_slave baseAddress 0x04c0
add_connection hps_0.h2f_lw_axi_master dma_dummy.control_port_slave avalon
set_connection_parameter_value hps_0.h2f_lw_axi_master/dma_dummy.control_port_slave baseAddress 0x0620
add_connection hps_0.h2f_lw_axi_master dma_fifo.control_port_slave avalon
set_connection_parameter_value hps_0.h2f_lw_axi_master/dma_fifo.control_port_slave baseAddress 0x0380
add_connection hps_0.h2f_lw_axi_master ffpts.s1 avalon
set_connection_parameter_value hps_0.h2f_lw_axi_master/ffpts.s1 baseAddress 0x0060
add_connection hps_0.h2f_lw_axi_master hs_spi.spi_control_port avalon
set_connection_parameter_value hps_0.h2f_lw_axi_master/hs_spi.spi_control_port baseAddress 0x0040
add_connection hps_0.h2f_lw_axi_master i2c_ext.csr avalon
set_connection_parameter_value hps_0.h2f_lw_axi_master/i2c_ext.csr baseAddress 0x0040
add_connection hps_0.h2f_lw_axi_master i2c_int.csr avalon
set_connection_parameter_value hps_0.h2f_lw_axi_master/i2c_int.csr baseAddress 0x0300
add_connection hps_0.h2f_lw_axi_master jtag_uart.avalon_jtag_slave avalon
set_connection_parameter_value hps_0.h2f_lw_axi_master/jtag_uart.avalon_jtag_slave baseAddress 0x0440
add_connection hps_0.h2f_lw_axi_master nmr_parameters.adc_val_sub_s1 avalon
set_connection_parameter_value hps_0.h2f_lw_axi_master/nmr_parameters.adc_val_sub_s1 baseAddress 0x0470
add_connection hps_0.h2f_lw_axi_master nmr_parameters.dec_fact_s1 avalon
set_connection_parameter_value hps_0.h2f_lw_axi_master/nmr_parameters.dec_fact_s1 baseAddress 0x0610
add_connection hps_0.h2f_lw_axi_master nmr_parameters.delay_nosig_s1 avalon
set_connection_parameter_value hps_0.h2f_lw_axi_master/nmr_parameters.delay_nosig_s1 baseAddress 0x0430
add_connection hps_0.h2f_lw_axi_master nmr_parameters.delay_sig_s1 avalon
set_connection_parameter_value hps_0.h2f_lw_axi_master/nmr_parameters.delay_sig_s1 baseAddress 0x0420
add_connection hps_0.h2f_lw_axi_master nmr_parameters.delay_t1_s1 avalon
set_connection_parameter_value hps_0.h2f_lw_axi_master/nmr_parameters.delay_t1_s1 baseAddress 0x0410
add_connection hps_0.h2f_lw_axi_master nmr_parameters.echo_skip_s1 avalon
set_connection_parameter_value hps_0.h2f_lw_axi_master/nmr_parameters.echo_skip_s1 baseAddress 0x0630
add_connection hps_0.h2f_lw_axi_master nmr_parameters.echoes_per_scan_s1 avalon
set_connection_parameter_value hps_0.h2f_lw_axi_master/nmr_parameters.echoes_per_scan_s1 baseAddress 0x0400
add_connection hps_0.h2f_lw_axi_master nmr_parameters.init_delay_s1 avalon
set_connection_parameter_value hps_0.h2f_lw_axi_master/nmr_parameters.init_delay_s1 baseAddress 0x03f0
add_connection hps_0.h2f_lw_axi_master nmr_parameters.mgnt_chg_dlen_s1 avalon
set_connection_parameter_value hps_0.h2f_lw_axi_master/nmr_parameters.mgnt_chg_dlen_s1 baseAddress 0x0620
add_connection hps_0.h2f_lw_axi_master nmr_parameters.mgnt_chg_plen_s1 avalon
set_connection_parameter_value hps_0.h2f_lw_axi_master/nmr_parameters.mgnt_chg_plen_s1 baseAddress 0x0600
add_connection hps_0.h2f_lw_axi_master nmr_parameters.mgnt_d_s1 avalon
set_connection_parameter_value hps_0.h2f_lw_axi_master/nmr_parameters.mgnt_d_s1 baseAddress 0x04f0
add_connection hps_0.h2f_lw_axi_master nmr_parameters.mgnt_dchg_dlen_s1 avalon
set_connection_parameter_value hps_0.h2f_lw_axi_master/nmr_parameters.mgnt_dchg_dlen_s1 baseAddress 0x04e0
add_connection hps_0.h2f_lw_axi_master nmr_parameters.mgnt_dchg_plen_s1 avalon
set_connection_parameter_value hps_0.h2f_lw_axi_master/nmr_parameters.mgnt_dchg_plen_s1 baseAddress 0x0450
add_connection hps_0.h2f_lw_axi_master nmr_parameters.mgnt_n_s1 avalon
set_connection_parameter_value hps_0.h2f_lw_axi_master/nmr_parameters.mgnt_n_s1 baseAddress 0x0070
add_connection hps_0.h2f_lw_axi_master nmr_parameters.pulse_90deg_s1 avalon
set_connection_parameter_value hps_0.h2f_lw_axi_master/nmr_parameters.pulse_90deg_s1 baseAddress 0x03d0
add_connection hps_0.h2f_lw_axi_master nmr_parameters.pulse_180deg_s1 avalon
set_connection_parameter_value hps_0.h2f_lw_axi_master/nmr_parameters.pulse_180deg_s1 baseAddress 0x03e0
add_connection hps_0.h2f_lw_axi_master nmr_parameters.pulse_t1_s1 avalon
set_connection_parameter_value hps_0.h2f_lw_axi_master/nmr_parameters.pulse_t1_s1 baseAddress 0x03c0
add_connection hps_0.h2f_lw_axi_master nmr_parameters.rx_delay_s1 avalon
set_connection_parameter_value hps_0.h2f_lw_axi_master/nmr_parameters.rx_delay_s1 baseAddress 0x0460
add_connection hps_0.h2f_lw_axi_master nmr_parameters.samples_per_echo_s1 avalon
set_connection_parameter_value hps_0.h2f_lw_axi_master/nmr_parameters.samples_per_echo_s1 baseAddress 0x0010
add_connection hps_0.h2f_lw_axi_master nmr_sys_pll_reconfig.mgmt_avalon_slave avalon
set_connection_parameter_value hps_0.h2f_lw_axi_master/nmr_sys_pll_reconfig.mgmt_avalon_slave baseAddress 0x0200
add_connection hps_0.h2f_lw_axi_master spi_afe_relays.spi_control_port avalon
set_connection_parameter_value hps_0.h2f_lw_axi_master/spi_afe_relays.spi_control_port baseAddress 0x0640
add_connection hps_0.h2f_lw_axi_master spi_mtch_ntwrk.spi_control_port avalon
set_connection_parameter_value hps_0.h2f_lw_axi_master/spi_mtch_ntwrk.spi_control_port baseAddress 0x0360
add_connection hps_0.h2f_lw_axi_master sysid_qsys.control_slave avalon
set_connection_parameter_value hps_0.h2f_lw_axi_master/sysid_qsys.control_slave baseAddress 0x0008
add_connection master_non_sec.master adc_fifo_mem.in_csr avalon
set_connection_parameter_value master_non_sec.master/adc_fifo_mem.in_csr baseAddress 0x0340
add_connection master_non_sec.master adc_fifo_mem.out avalon
set_connection_parameter_value master_non_sec.master/adc_fifo_mem.out baseAddress 0x0000
add_connection master_non_sec.master alt_vip_vfr_vga.avalon_slave avalon
set_connection_parameter_value master_non_sec.master/alt_vip_vfr_vga.avalon_slave baseAddress 0x0080
add_connection master_non_sec.master analyzer_pll_reconfig.mgmt_avalon_slave avalon
set_connection_parameter_value master_non_sec.master/analyzer_pll_reconfig.mgmt_avalon_slave baseAddress 0x0100
add_connection master_non_sec.master aux_cnt_out.s1 avalon
set_connection_parameter_value master_non_sec.master/aux_cnt_out.s1 baseAddress 0x0450
add_connection master_non_sec.master ctrl_in.s1 avalon
set_connection_parameter_value master_non_sec.master/ctrl_in.s1 baseAddress 0x03a0
add_connection master_non_sec.master ctrl_out.s1 avalon
set_connection_parameter_value master_non_sec.master/ctrl_out.s1 baseAddress 0x03b0
add_connection master_non_sec.master dac_grad.spi_control_port avalon
set_connection_parameter_value master_non_sec.master/dac_grad.spi_control_port baseAddress 0x0020
add_connection master_non_sec.master dac_preamp.spi_control_port avalon
set_connection_parameter_value master_non_sec.master/dac_preamp.spi_control_port baseAddress 0x04a0
add_connection master_non_sec.master dconv_fifo_mem.in_csr avalon
set_connection_parameter_value master_non_sec.master/dconv_fifo_mem.in_csr baseAddress 0x0480
add_connection master_non_sec.master dconv_fifo_mem.out avalon
set_connection_parameter_value master_non_sec.master/dconv_fifo_mem.out baseAddress 0x0448
add_connection master_non_sec.master dconv_fir.avalon_mm_slave avalon
set_connection_parameter_value master_non_sec.master/dconv_fir.avalon_mm_slave baseAddress 0x0500
add_connection master_non_sec.master dconv_fir_q.avalon_mm_slave avalon
set_connection_parameter_value master_non_sec.master/dconv_fir_q.avalon_mm_slave baseAddress 0x0580
add_connection master_non_sec.master i2c_ext.csr avalon
set_connection_parameter_value master_non_sec.master/i2c_ext.csr baseAddress 0x0040
add_connection master_non_sec.master i2c_int.csr avalon
set_connection_parameter_value master_non_sec.master/i2c_int.csr baseAddress 0x0300
add_connection master_non_sec.master jtag_uart.avalon_jtag_slave avalon
set_connection_parameter_value master_non_sec.master/jtag_uart.avalon_jtag_slave baseAddress 0x0440
add_connection master_non_sec.master nmr_parameters.adc_val_sub_s1 avalon
set_connection_parameter_value master_non_sec.master/nmr_parameters.adc_val_sub_s1 baseAddress 0x0470
add_connection master_non_sec.master nmr_parameters.dec_fact_s1 avalon
set_connection_parameter_value master_non_sec.master/nmr_parameters.dec_fact_s1 baseAddress 0x0610
add_connection master_non_sec.master nmr_parameters.delay_nosig_s1 avalon
set_connection_parameter_value master_non_sec.master/nmr_parameters.delay_nosig_s1 baseAddress 0x0430
add_connection master_non_sec.master nmr_parameters.delay_sig_s1 avalon
set_connection_parameter_value master_non_sec.master/nmr_parameters.delay_sig_s1 baseAddress 0x0420
add_connection master_non_sec.master nmr_parameters.delay_t1_s1 avalon
set_connection_parameter_value master_non_sec.master/nmr_parameters.delay_t1_s1 baseAddress 0x0410
add_connection master_non_sec.master nmr_parameters.echo_skip_s1 avalon
set_connection_parameter_value master_non_sec.master/nmr_parameters.echo_skip_s1 baseAddress 0x0630
add_connection master_non_sec.master nmr_parameters.echoes_per_scan_s1 avalon
set_connection_parameter_value master_non_sec.master/nmr_parameters.echoes_per_scan_s1 baseAddress 0x0400
add_connection master_non_sec.master nmr_parameters.init_delay_s1 avalon
set_connection_parameter_value master_non_sec.master/nmr_parameters.init_delay_s1 baseAddress 0x03f0
add_connection master_non_sec.master nmr_parameters.mgnt_chg_dlen_s1 avalon
set_connection_parameter_value master_non_sec.master/nmr_parameters.mgnt_chg_dlen_s1 baseAddress 0x0620
add_connection master_non_sec.master nmr_parameters.mgnt_chg_plen_s1 avalon
set_connection_parameter_value master_non_sec.master/nmr_parameters.mgnt_chg_plen_s1 baseAddress 0x0600
add_connection master_non_sec.master nmr_parameters.mgnt_d_s1 avalon
set_connection_parameter_value master_non_sec.master/nmr_parameters.mgnt_d_s1 baseAddress 0x04f0
add_connection master_non_sec.master nmr_parameters.mgnt_dchg_dlen_s1 avalon
set_connection_parameter_value master_non_sec.master/nmr_parameters.mgnt_dchg_dlen_s1 baseAddress 0x04e0
add_connection master_non_sec.master nmr_parameters.mgnt_dchg_plen_s1 avalon
set_connection_parameter_value master_non_sec.master/nmr_parameters.mgnt_dchg_plen_s1 baseAddress 0x0450
add_connection master_non_sec.master nmr_parameters.mgnt_n_s1 avalon
set_connection_parameter_value master_non_sec.master/nmr_parameters.mgnt_n_s1 baseAddress 0x0070
add_connection master_non_sec.master nmr_parameters.pulse_90deg_s1 avalon
set_connection_parameter_value master_non_sec.master/nmr_parameters.pulse_90deg_s1 baseAddress 0x03d0
add_connection master_non_sec.master nmr_parameters.pulse_180deg_s1 avalon
set_connection_parameter_value master_non_sec.master/nmr_parameters.pulse_180deg_s1 baseAddress 0x03e0
add_connection master_non_sec.master nmr_parameters.pulse_t1_s1 avalon
set_connection_parameter_value master_non_sec.master/nmr_parameters.pulse_t1_s1 baseAddress 0x03c0
add_connection master_non_sec.master nmr_parameters.rx_delay_s1 avalon
set_connection_parameter_value master_non_sec.master/nmr_parameters.rx_delay_s1 baseAddress 0x0460
add_connection master_non_sec.master nmr_parameters.samples_per_echo_s1 avalon
set_connection_parameter_value master_non_sec.master/nmr_parameters.samples_per_echo_s1 baseAddress 0x0010
add_connection master_non_sec.master nmr_sys_pll_reconfig.mgmt_avalon_slave avalon
set_connection_parameter_value master_non_sec.master/nmr_sys_pll_reconfig.mgmt_avalon_slave baseAddress 0x0200
add_connection master_non_sec.master spi_afe_relays.spi_control_port avalon
set_connection_parameter_value master_non_sec.master/spi_afe_relays.spi_control_port baseAddress 0x0640
add_connection master_non_sec.master spi_mtch_ntwrk.spi_control_port avalon
set_connection_parameter_value master_non_sec.master/spi_mtch_ntwrk.spi_control_port baseAddress 0x0360
add_connection master_non_sec.master sysid_qsys.control_slave avalon
set_connection_parameter_value master_non_sec.master/sysid_qsys.control_slave baseAddress 0x0008
add_connection master_secure.master hps_0.f2h_axi_slave avalon
set_connection_parameter_value master_secure.master/hps_0.f2h_axi_slave baseAddress 0x0000
add_connection adc_fifo_dc.out adc_fifo_mem.in avalon_streaming
add_connection alt_vip_vfr_vga.avalon_streaming_source alt_vip_itc_0.din avalon_streaming
add_connection dconv_fifo_dc.out dconv_fifo_mem.in avalon_streaming
add_connection fifo_dummy64_in.out fifo_dummy64_out.in avalon_streaming
add_connection analyzer_pll.reconfig_to_pll analyzer_pll_reconfig.reconfig_to_pll conduit
add_connection analyzer_pll_reconfig.reconfig_from_pll analyzer_pll.reconfig_from_pll conduit
add_connection nmr_sys_pll_reconfig.reconfig_from_pll nmr_sys_pll.reconfig_from_pll conduit
add_connection nmr_sys_pll_reconfig.reconfig_to_pll nmr_sys_pll.reconfig_to_pll conduit
add_connection hps_0.f2h_irq0 alt_vip_vfr_vga.interrupt_sender interrupt
set_connection_parameter_value hps_0.f2h_irq0/alt_vip_vfr_vga.interrupt_sender irqNumber 0
add_connection hps_0.f2h_irq0 jtag_uart.irq interrupt
set_connection_parameter_value hps_0.f2h_irq0/jtag_uart.irq irqNumber 2
add_connection hps_0.f2h_irq1 dac_grad.irq interrupt
set_connection_parameter_value hps_0.f2h_irq1/dac_grad.irq irqNumber 2
add_connection hps_0.f2h_irq1 dac_preamp.irq interrupt
set_connection_parameter_value hps_0.f2h_irq1/dac_preamp.irq irqNumber 6
add_connection hps_0.f2h_irq1 dma_dconvi.irq interrupt
set_connection_parameter_value hps_0.f2h_irq1/dma_dconvi.irq irqNumber 5
add_connection hps_0.f2h_irq1 dma_fifo.irq interrupt
set_connection_parameter_value hps_0.f2h_irq1/dma_fifo.irq irqNumber 0
add_connection hps_0.f2h_irq1 hs_spi.irq interrupt
set_connection_parameter_value hps_0.f2h_irq1/hs_spi.irq irqNumber 4
add_connection hps_0.f2h_irq1 i2c_ext.interrupt_sender interrupt
set_connection_parameter_value hps_0.f2h_irq1/i2c_ext.interrupt_sender irqNumber 4
add_connection hps_0.f2h_irq1 i2c_int.interrupt_sender interrupt
set_connection_parameter_value hps_0.f2h_irq1/i2c_int.interrupt_sender irqNumber 1
add_connection hps_0.f2h_irq1 spi_afe_relays.irq interrupt
set_connection_parameter_value hps_0.f2h_irq1/spi_afe_relays.irq irqNumber 7
add_connection hps_0.f2h_irq1 spi_mtch_ntwrk.irq interrupt
set_connection_parameter_value hps_0.f2h_irq1/spi_mtch_ntwrk.irq irqNumber 3
